# Altium schematic sheet Sensors.SchDoc
size A; SheetNumber: 3; SheetTotal: 3
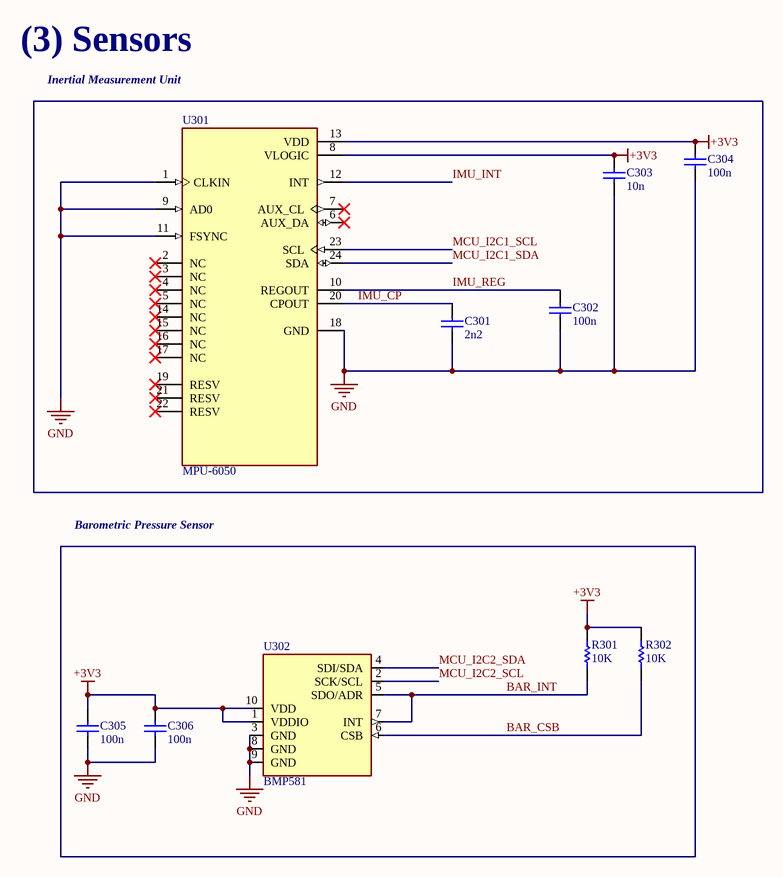
[diagram p0: Sensors.SchDoc]

## Parts
C301  value 2n2  [CAP-SM-0805]  (hidden comment: Cap Non-Pol SMD)
C302  value 100n  [CAP-SM-0805]  (hidden comment: Cap Non-Pol SMD)
C303  value 10n  [CAP-SM-0805]  (hidden comment: Cap Non-Pol SMD)
C304  value 100n  [CAP-SM-0805]  (hidden comment: Cap Non-Pol SMD)
C305  value 100n  [CAP-SM-0805]  (hidden comment: Cap Non-Pol SMD)
C306  value 100n  [CAP-SM-0805]  (hidden comment: Cap Non-Pol SMD)
R301  value 10K  [RES-SM-0603]  (hidden comment: RESISTOR SMD)
R302  value 10K  [RES-SM-0603]  (hidden comment: RESISTOR SMD)
U301  MPU-6050  [QFN50P400X400X95-24N]
U302  BMP581  [BMP581]

## Nets
+3V3: C303.2 C304.1 C305.2 C306.2 R301.2 R302.2 U301.8(VLOGIC) U301.13(VDD) U302.1(VDDIO) U302.10(VDD)
GND: C301.1 C302.1 C303.1 C304.2 C305.1 C306.1 U301.1(CLKIN) U301.9(AD0) U301.11(FSYNC) U301.18(GND) U302.3(GND) U302.8(GND) U302.9(GND)
BAR_CSB: R302.1 U302.6(CSB)
BAR_INT: R301.1 U302.5(SDO/ADR) U302.7(INT)
IMU_CP: C301.2 U301.20(CPOUT)
IMU_INT: U301.12(INT)
IMU_REG: C302.2 U301.10(REGOUT)
MCU_I2C1_SCL: U301.23(SCL)
MCU_I2C1_SDA: U301.24(SDA)
MCU_I2C2_SCL: U302.2(SCK/SCL)
MCU_I2C2_SDA: U302.4(SDI/SDA)

Not connected (* = marked no-connect by the designer): U301 2(NC)* 3(NC)* 4(NC)* 5(NC)* 6(AUX_DA)* 7(AUX_CL)* 14(NC)* 15(NC)* 16(NC)* 17(NC)* 19(RESV)* 21(RESV)* 22(RESV)*

## Notes on the sheet
- (3) Sensors
- Inertial Measurement Unit
- Barometric Pressure Sensor

## Library data of the parts
C301-C306 = Cap Non-Pol SMD: Capacitor
R301 R302 = RESISTOR SMD: Resistor
U301 = MPU-6050: MPU-6050 series Accelerometer, Gyroscope, 3 Axis Sensor Evaluation Board; MF: TDK InvenSense; SnapEDA_Link: https://www.snapeda.com/parts/MPU-6050/TDK+InvenSense/view-part/?ref=snap; Package: QFN-24 InvenSense; Value: *; MP: MPU-6050; Check_prices: https://www.snapeda.com/parts/MPU-6050/TDK+InvenSense/view-part/?ref=eda
U302 = BMP581: Very small, low-power and low noise 24-bit absolute barometric pressure sensor. This digital, high-performance sensor is ideally suited for a wide range of altitude tracking applications and offers outstanding design flexibility; MF: Bosch; Package: None; Price: None; Value: *; SnapEDA_Link: https://www.snapeda.com/parts/BMP581/Bosch/view-part/?ref=snap; MP: BMP581; Availability: Unavailable; Check_prices: https://www.snapeda.com/parts/BMP581/Bosch/view-part/?ref=eda